# Altium schematic sheet E-0056_TMC2130.SchDoc: Motor Driver & Sensors
size A; Author: Luka & Emile; DrawnBy: Luka & Emile; DocumentNumber: E-0056; Revision: 1; SheetNumber: 3; SheetTotal: 3
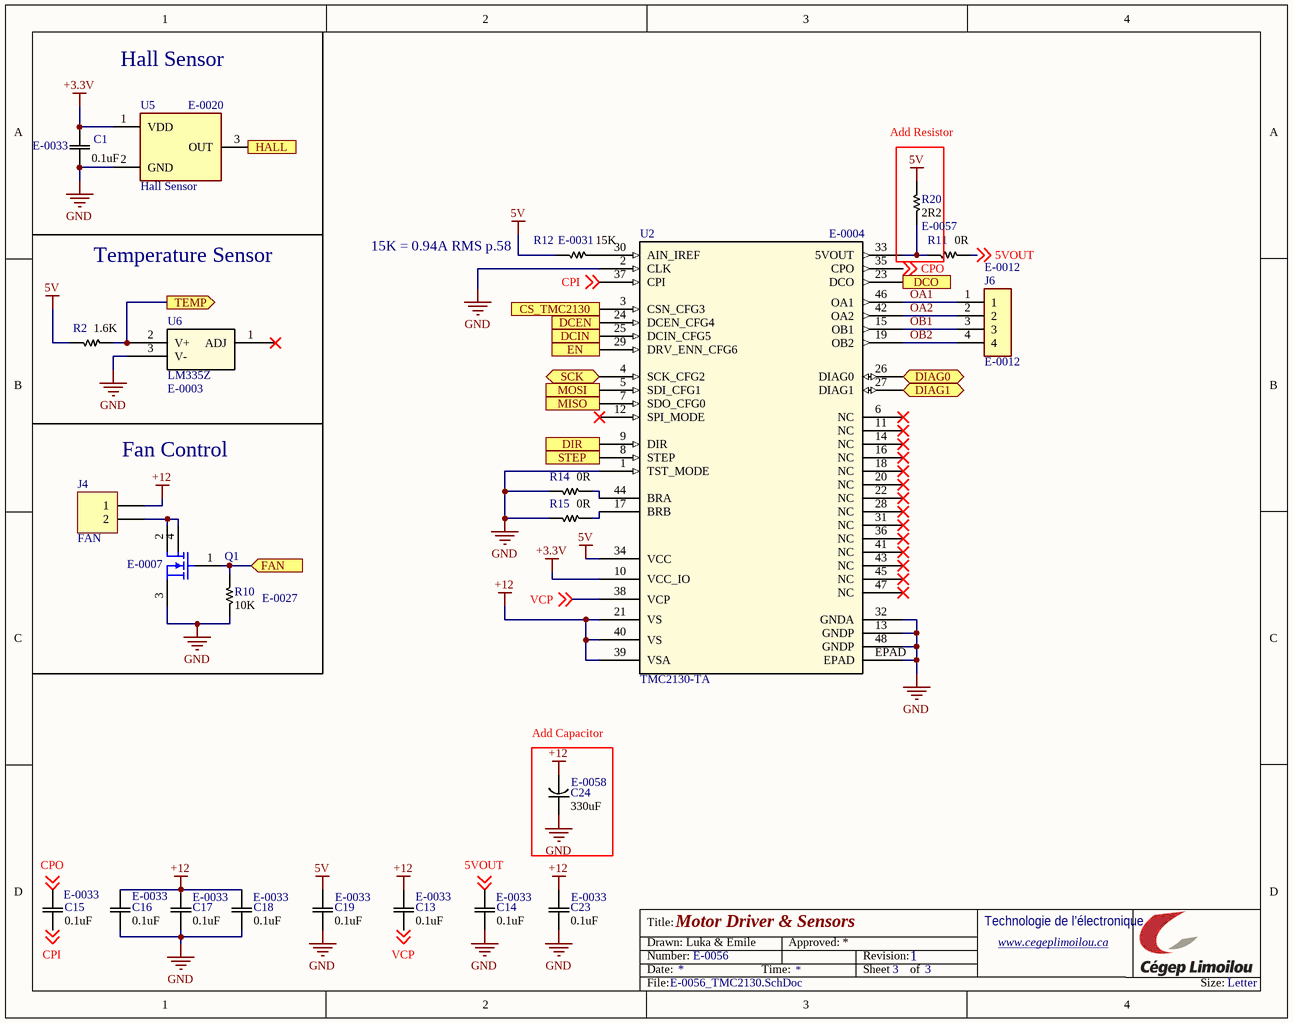
[diagram p0: E-0056_TMC2130.SchDoc]

## Parts
C1  value 0.1uF  [0603]  (hidden comment: E-0033)
C13  value 0.1uF  [0603]  (hidden comment: E-0033)
C14  value 0.1uF  [0603]  (hidden comment: E-0033)
C15  value 0.1uF  [0603]  (hidden comment: E-0033)
C16  value 0.1uF  [0603]  (hidden comment: E-0033)
C17  value 0.1uF  [0603]  (hidden comment: E-0033)
C18  value 0.1uF  [0603]  (hidden comment: E-0033)
C19  value 0.1uF  [0603]  (hidden comment: E-0033)
C23  value 0.1uF  [0603]  (hidden comment: E-0033)
C24  value 330uF  [0603]  (hidden comment: Capacitor SMD)
J4  FAN  [HDR1X2]
J6  E-0012  [JST 4POS 2.5mm 90°]
Q1  E-0007  [SOT223_M]
R2  value 1.6K  [0603]  (hidden comment: E-0050)
R10  value 10K  [0603]  (hidden comment: Resistor 0603)
R11  value 0R  [0603]  (hidden comment: Jumper)
R12  value 15K  [0603]  (hidden comment: E-0031)
R14  value 0R  [0603]  (hidden comment: Jumper)
R15  value 0R  [0603]  (hidden comment: Jumper)
R20  value 2R2  [0603]  (hidden comment: Resistor 0603)
U2  TMC2130-TA  [eTQFP48_9x9]
U5  Hall Sensor  [AH372PB]
U6  LM335Z  [TO92]

## Blocks framed on the sheet
Add Capacitor: C24

## Ports
CS_TMC2130 (in), DCEN (in), DCIN (in), DCO (out), DIAG0 (bidir), DIAG1 (bidir), DIR (in), EN (in), FAN (in), HALL (out), MISO (out), MOSI (in), SCK (bidir), STEP (in), TEMP (out)

## Nets
5V: C19.2 R2.1 R12.1 R20.2 U2.34(VCC)
+3.3V: C1.2 U2.10(VCC_IO) U5.1(VDD)
+12: C13.2 C16.2 C17.2 C18.2 C23.2 C24.2 J4.1 U2.21(VS) U2.39(VSA) U2.40(VS)
GND: C1.1 C14.1 C16.1 C17.1 C18.1 C19.1 C23.1 C24.1 Q1.3(S) R10.1 R14.1 R15.1 U2.1(TST_MODE) U2.2(CLK) U2.13(GNDP) U2.32(GNDA) U2.48(GNDP) U2.EPAD U5.2(GND) U6.3(V-)
5VOUT: C14.2 R11.2 ; off-sheet 5VOUT
CPI: C15.1 U2.37(CPI) ; off-sheet CPI
CPO: C15.2 U2.35(CPO) ; off-sheet CPO
CS_TMC2130: U2.3(CSN_CFG3) ; port CS_TMC2130
DCEN: U2.24(DCEN_CFG4) ; port DCEN
DCIN: U2.25(DCIN_CFG5) ; port DCIN
DCO: U2.23(DCO) ; port DCO
DIAG0: U2.26(DIAG0) ; port DIAG0
DIAG1: U2.27(DIAG1) ; port DIAG1
DIR: U2.9(DIR) ; port DIR
EN: U2.29(DRV_ENN_CFG6) ; port EN
FAN: Q1.1(G) R10.2 ; port FAN
HALL: U5.3(OUT) ; port HALL
MISO: U2.7(SDO_CFG0) ; port MISO
MOSI: U2.5(SDI_CFG1) ; port MOSI
OA1: J6.1 U2.46(OA1)
OA2: J6.2 U2.42(OA2)
OB1: J6.3 U2.15(OB1)
OB2: J6.4 U2.19(OB2)
SCK: U2.4(SCK_CFG2) ; port SCK
STEP: U2.8(STEP) ; port STEP
TEMP: R2.2 U6.2(V+) ; port TEMP
VCP: C13.1 U2.38(VCP) ; off-sheet VCP
NetJ4_2: J4.2 Q1.2(D) Q1.4(D)
NetR11_1: R11.1 R20.1 U2.33(5VOUT)
NetR12_2: R12.2 U2.30(AIN_IREF)
NetR14_2: R14.2 U2.44(BRA)
NetR15_2: R15.2 U2.17(BRB)

Not connected (* = marked no-connect by the designer): U2 6(NC)* 11(NC)* 12(SPI_MODE)* 14(NC)* 16(NC)* 18(NC)* 20(NC)* 22(NC)* 28(NC)* 31(NC)* 36(NC)* 41(NC)* 43(NC)* 45(NC)* 47(NC)*; U6 1(ADJ)*

## Notes on the sheet
- Hall Sensor
- Add Resistor
- Temperature Sensor
- (near R12) 15K = 0.94A RMS p.58
- (near J4) Fan Control
- Title:
- Number:
- Date:
- Drawn:
- Time:
- Approved:
- Revision:
- Sheet
- of
- Technologie de l’électronique
- www.cegeplimoilou.ca
- File:
- Size:
- Letter

## Library data of the parts
C1 C13-C19 C23 = E-0033: 0.1uF Capacitor 0603 SMD; Manufacturer_Part_Number: C0603C104Z3VACTU; Manufacturer_Name: KEMET; Built_By: Luka & Émile; Vendor: https://www.digikey.ca/product-detail/en/C0603C104Z3VACTU/399-1100-1-ND/411375/?itemSeq=321556474; Copyright: Luka & Émile; Datasheet Link: http://www.koaspeer.com/pdfs/RK73B.pdf; Excel Number: E-0033
C24 = E-0058: 330uF Capacitor TH; Manufacturer_Part_Number: C0603C475K9PACTU; Manufacturer_Name: KEMET; Built_By: Luka & Émile; Vendor: https://www.digikey.ca/product-detail/en/kemet/C0603C475K9PACTU/399-3482-1-ND/754775; Copyright: Luka & Émile; Datasheet Link: https://content.kemet.com/datasheets/KEM_C1006_X5R_SMD.pdf; Excel Number: E-0058
J4 = E-0047: Header, 2-Pin; Manufacturer_Name: Würth Elektronik; Manufacturer_Part_Number: 61300411121; Built_By: Luka & Émile; Copyright: Luka & Émile; Datasheet Link: https://www.we-online.de/katalog/datasheet/6130xx11121.pdf; Excel Number: E-0047; Vendor: 61300411121
J6 = E-0012: Connector JST 4POS; Manufacturer_Name: JST Sales America Inc.; Manufacturer_Part_Number: S4B-XH-A(LF)(SN); Built_By: Luka & Émile; Datasheet Link: http://www.jst-mfg.com/product/pdf/eng/eXH.pdf; Copyright: Luka & Émile; Vendor: https://www.digikey.ca/product-detail/en/jst-sales-america-inc/S4B-XH-A(LF)(SN)/455-2243-ND/1651041; Excel Number: E-0012
Q1 = E-0007: 55V 7A SOT223; Manufacturer_Name: Nexperia USA Inc.; Manufacturer_Part_Number: BUK9880-55A/CUX; Built_By: Luka & Émile; Copyright: Luka & Émile; Datasheet Link: https://assets.nexperia.com/documents/data-sheet/BUK9880-55A.pdf; Excel Number: E-0007; Vendor: https://www.digikey.ca/product-detail/en/nexperia-usa-inc/BUK9880-55A-CUX/1727-2230-1-ND/5361200
R2 = E-0050: 1.6K Resistor 0603 SMD; Manufacturer_Part_Number: CRCW06031K60JNEA; Manufacturer_Name: Vishay Dale; Built_By: Luka & Émile; Vendor: https://www.digikey.ca/en/products/detail/vishay-dale/CRCW06031K60JNEA/1174234; Copyright: Luka & Émile; Excel Number: E-0050; Datasheet Link: N/A
R10 = E-0027: 10K Resistor 0603 SMD; Manufacturer_Part_Number: RMCF0603JT10K0; Manufacturer_Name: Stackpole Electronics Inc; Built_By: Luka & Émile; Vendor: https://www.digikey.ca/product-detail/en/RMCF0603JT10K0/RMCF0603JT10K0CT-ND/1943191/?itemSeq=321633246; Copyright: Luka & Émile; Datasheet Link: https://www.seielect.com/catalog/sei-rmcf_rmcp.pdf; Excel Number: E-0027
R11 R14 R15 = Jumper: Jumper 0603; Built_By: Luka & Émile; Copyright: Luka & Émile
R12 = E-0031: 15K Resistor 0603 SMD; Manufacturer_Part_Number: RMCF0603FG15K0; Manufacturer_Name: Stackpole Electronics Inc; Built_By: Luka & Émile; Vendor: https://www.digikey.ca/product-detail/en/RMCF0603FG15K0/RMCF0603FG15K0CT-ND/4425035/?itemSeq=321674385; Copyright: Luka & Émile; Datasheet Link: https://www.seielect.com/catalog/sei-rmcf_rmcp.pdf; Excel Number: E-0031
R20 = E-0057: 2R2 Resistor 0603 SMD; Manufacturer_Part_Number: CRCW06031K60JNEA; Manufacturer_Name: Vishay Dale; Built_By: Luka & Émile; Vendor: https://www.digikey.ca/en/products/detail/vishay-dale/CRCW06031K60JNEA/1174234; Copyright: Luka & Émile; Datasheet Link: N/A; Excel Number: E-0057
U2 = E-0004: Motor Driver TMC2130-TA; Manufacturer_Part_Number: TMC2130-TA-T; Manufacturer_Name: Trinamic Motion Control GmbH; Built_By: Luka & Émile; Copyright: Luka & Émile; Vendor: https://www.digikey.ca/product-detail/en/trinamic-motion-control-gmbh/TMC2130-TA-T/1460-1186-1-ND/6572873; Datasheet Link: https://www.trinamic.com/fileadmin/assets/Products/ICs_Documents/TMC2130_datasheet.pdf; Excel Number: E-0004
U5 = E-0020: Manufacturer_Name: Diodes Incorporated; Manufacturer_Part_Number: AH372-P-B; Built_By: Luka & Émile; Datasheet Link: https://www.diodes.com/assets/Datasheets/AH372.pdf; Copyright: Luka & Émile; Vendor: https://www.digikey.ca/products/en?keywords=621-AH372-P-B; Excel Number: E-0020
U6 = E-0003: Temperature Sensor LM335Z; Manufacturer_Name: STMicroelectronics; Built_By: Luka & Émile; VENDOR: https://www.digikey.ca/product-detail/en/stmicroelectronics/LM335Z/497-1584-ND/591686; MANUFACTURER_PART_NUMBER: LM335Z; Copyright: Luka & Émile; Datasheet Link: https://www.st.com/content/ccc/resource/technical/document/datasheet/04/fa/9d/16/39/87/44/8d/CD00000459.pdf/files/CD00000459.pdf/jcr:content/translations/en.CD00000459.pdf; Excel Number: E-0003